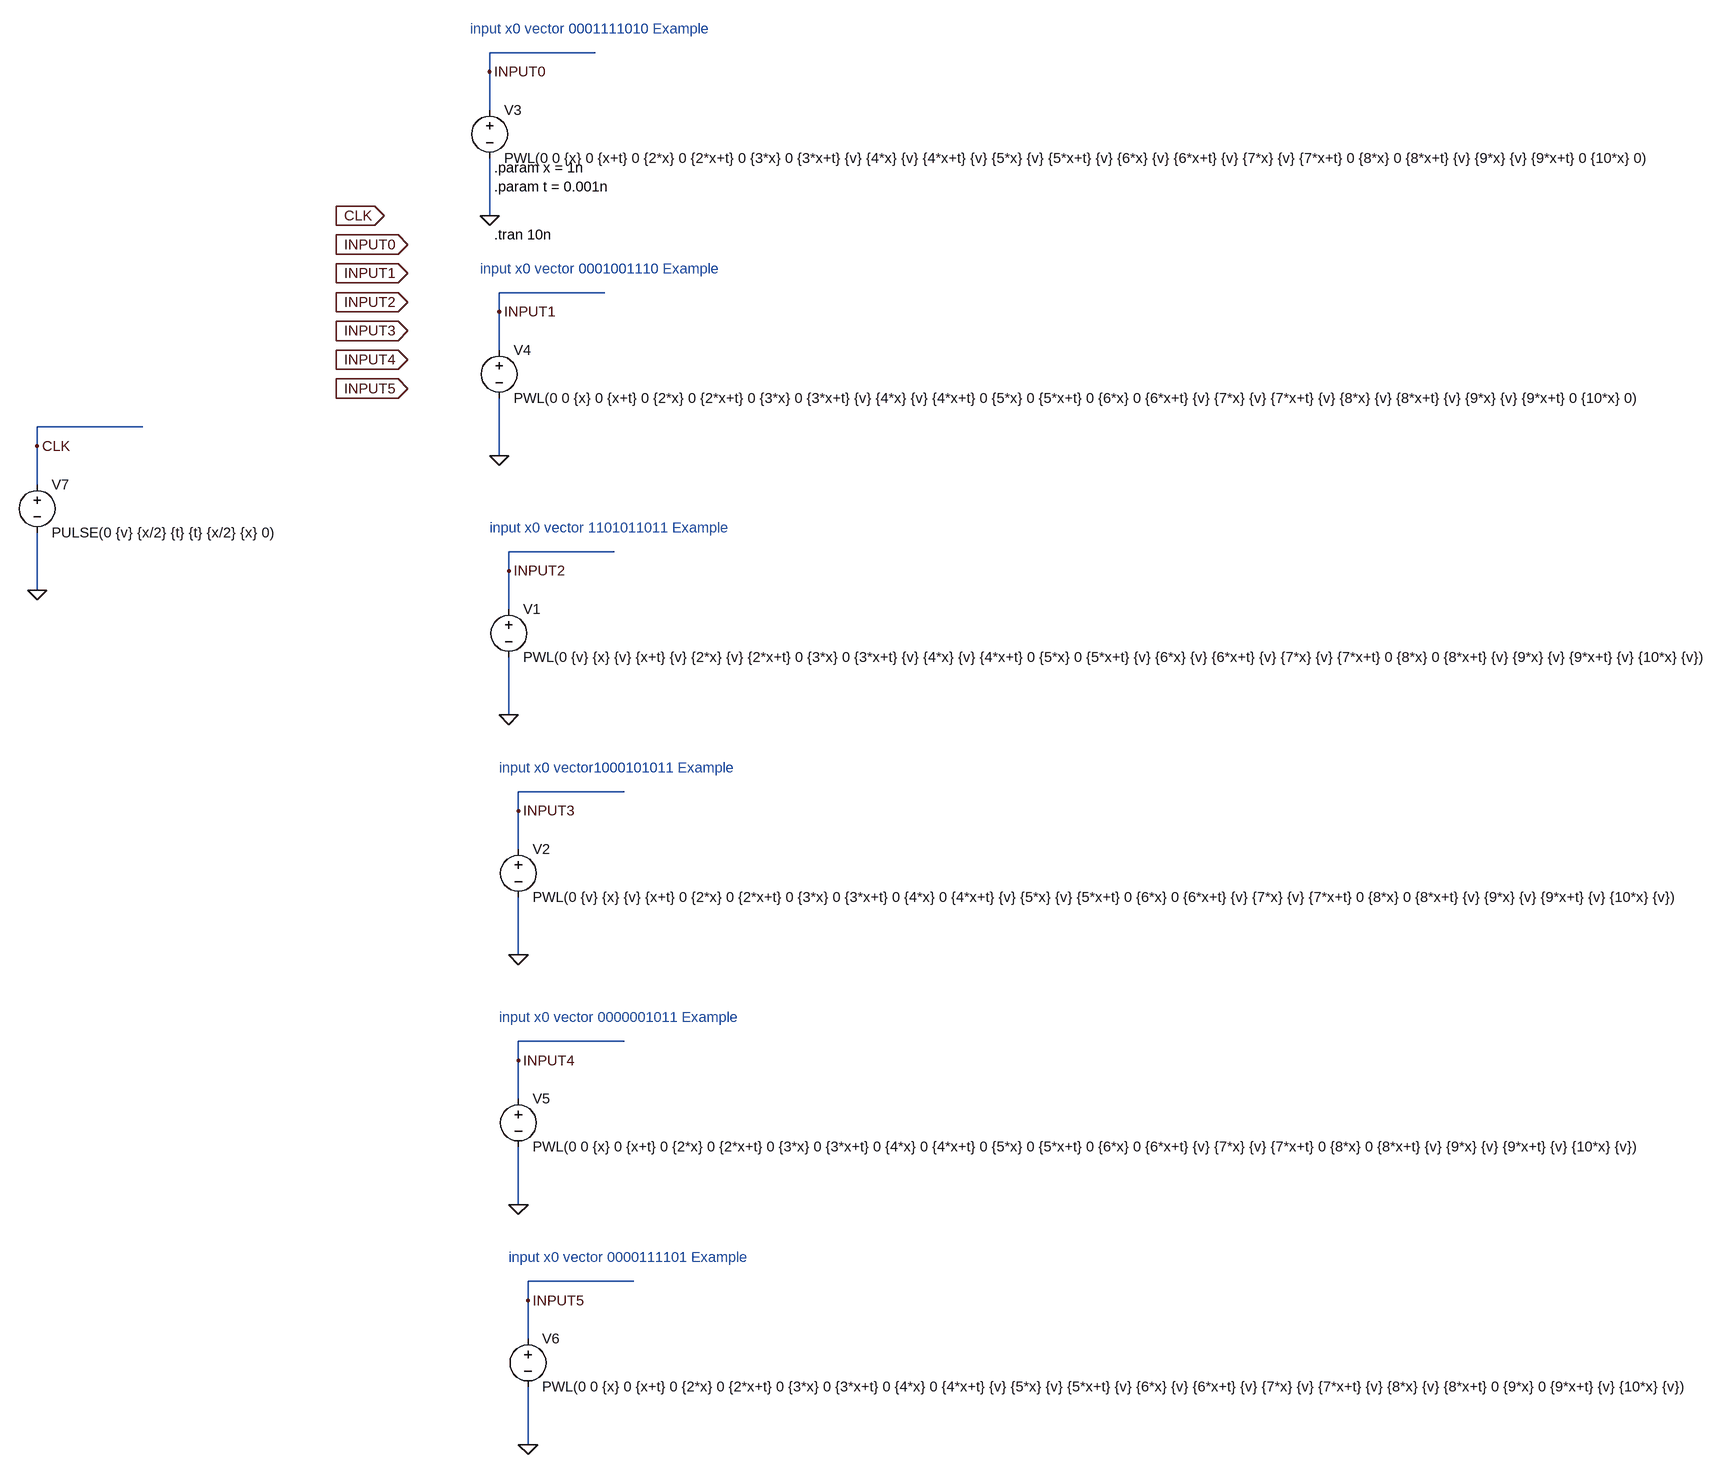
[diagram p0: schematic INPUT_GEN.asc]
INPUT_GEN.asc, the LTspice schematic file:
Version 4
SHEET 1 1944 1504
WIRE -528 -864 -704 -864
WIRE -704 -832 -704 -864
WIRE -704 -768 -704 -832
WIRE -704 -592 -704 -688
WIRE -512 -464 -688 -464
WIRE -688 -432 -688 -464
WIRE -688 -368 -688 -432
WIRE -2192 -240 -2368 -240
WIRE -2368 -208 -2368 -240
WIRE -688 -192 -688 -288
WIRE -2368 -144 -2368 -208
WIRE -496 -32 -672 -32
WIRE -672 0 -672 -32
WIRE -2368 32 -2368 -64
WIRE -672 64 -672 0
WIRE -672 240 -672 144
WIRE -480 368 -656 368
WIRE -656 400 -656 368
WIRE -656 464 -656 400
WIRE -656 640 -656 544
WIRE -480 784 -656 784
WIRE -656 816 -656 784
WIRE -656 880 -656 816
WIRE -656 1056 -656 960
WIRE -464 1184 -640 1184
WIRE -640 1216 -640 1184
WIRE -640 1280 -640 1216
WIRE -640 1456 -640 1360
FLAG -672 240 0
FLAG -672 0 INPUT2
FLAG -656 640 0
FLAG -656 400 INPUT3
FLAG -704 -592 0
FLAG -704 -832 INPUT0
FLAG -688 -192 0
FLAG -688 -432 INPUT1
FLAG -656 1056 0
FLAG -656 816 INPUT4
FLAG -640 1456 0
FLAG -640 1216 INPUT5
FLAG -2368 32 0
FLAG -2368 -208 CLK
FLAG -1856 -592 CLK
IOPIN -1856 -592 Out
FLAG -1856 -496 INPUT1
IOPIN -1856 -496 Out
FLAG -1856 -448 INPUT2
IOPIN -1856 -448 Out
FLAG -1856 -400 INPUT3
IOPIN -1856 -400 Out
FLAG -1856 -352 INPUT4
IOPIN -1856 -352 Out
FLAG -1856 -304 INPUT5
IOPIN -1856 -304 Out
FLAG -1856 -544 INPUT0
IOPIN -1856 -544 Out
SYMBOL voltage -672 48 R0
WINDOW 123 0 0 Left 0
WINDOW 39 0 0 Left 0
SYMATTR InstName V1
SYMATTR Value PWL(0 {v} {x} {v} {x+t} {v} {2*x} {v} {2*x+t} 0 {3*x} 0 {3*x+t} {v} {4*x} {v} {4*x+t} 0 {5*x} 0 {5*x+t} {v} {6*x} {v} {6*x+t} {v} {7*x} {v} {7*x+t} 0 {8*x} 0 {8*x+t} {v} {9*x} {v} {9*x+t} {v} {10*x} {v})
SYMBOL voltage -656 448 R0
WINDOW 123 0 0 Left 0
WINDOW 39 0 0 Left 0
SYMATTR InstName V2
SYMATTR Value PWL(0 {v} {x} {v} {x+t} 0 {2*x} 0 {2*x+t} 0 {3*x} 0 {3*x+t} 0 {4*x} 0 {4*x+t} {v} {5*x} {v} {5*x+t} 0 {6*x} 0 {6*x+t} {v} {7*x} {v} {7*x+t} 0 {8*x} 0 {8*x+t} {v} {9*x} {v} {9*x+t} {v} {10*x} {v})
SYMBOL voltage -704 -784 R0
WINDOW 123 0 0 Left 0
WINDOW 39 0 0 Left 0
SYMATTR InstName V3
SYMATTR Value PWL(0 0 {x} 0 {x+t} 0 {2*x} 0 {2*x+t} 0 {3*x} 0 {3*x+t} {v} {4*x} {v} {4*x+t} {v} {5*x} {v} {5*x+t} {v} {6*x} {v} {6*x+t} {v} {7*x} {v} {7*x+t} 0 {8*x} 0 {8*x+t} {v} {9*x} {v} {9*x+t} 0 {10*x} 0)
SYMBOL voltage -688 -384 R0
WINDOW 123 0 0 Left 0
WINDOW 39 0 0 Left 0
SYMATTR InstName V4
SYMATTR Value PWL(0 0 {x} 0 {x+t} 0 {2*x} 0 {2*x+t} 0 {3*x} 0 {3*x+t} {v} {4*x} {v} {4*x+t} 0 {5*x} 0 {5*x+t} 0 {6*x} 0 {6*x+t} {v} {7*x} {v} {7*x+t} {v} {8*x} {v} {8*x+t} {v} {9*x} {v} {9*x+t} 0 {10*x} 0)
SYMBOL voltage -656 864 R0
WINDOW 123 0 0 Left 0
WINDOW 39 0 0 Left 0
SYMATTR InstName V5
SYMATTR Value PWL(0 0 {x} 0 {x+t} 0 {2*x} 0 {2*x+t} 0 {3*x} 0 {3*x+t} 0 {4*x} 0 {4*x+t} 0 {5*x} 0 {5*x+t} 0 {6*x} 0 {6*x+t} {v} {7*x} {v} {7*x+t} 0 {8*x} 0 {8*x+t} {v} {9*x} {v} {9*x+t} {v} {10*x} {v})
SYMBOL voltage -640 1264 R0
WINDOW 123 0 0 Left 0
WINDOW 39 0 0 Left 0
SYMATTR InstName V6
SYMATTR Value PWL(0 0 {x} 0 {x+t} 0 {2*x} 0 {2*x+t} 0 {3*x} 0 {3*x+t} 0 {4*x} 0 {4*x+t} {v} {5*x} {v} {5*x+t} {v} {6*x} {v} {6*x+t} {v} {7*x} {v} {7*x+t} {v} {8*x} {v} {8*x+t} 0 {9*x} 0 {9*x+t} {v} {10*x} {v})
SYMBOL voltage -2368 -160 R0
WINDOW 123 0 0 Left 0
WINDOW 39 0 0 Left 0
SYMATTR InstName V7
SYMATTR Value PULSE(0 {v} {x/2} {t} {t} {x/2} {x} 0)
TEXT -704 -72 Left 2 ;input x0 vector 1101011011 Example
TEXT -688 328 Left 2 ;input x0 vector1000101011 Example
TEXT -696 -672 Left 2 !.param x = 1n
TEXT -696 -640 Left 2 !.param t = 0.001n
TEXT -696 -560 Left 2 !.tran 10n
TEXT -736 -904 Left 2 ;input x0 vector 0001111010 Example
TEXT -720 -504 Left 2 ;input x0 vector 0001001110 Example
TEXT -688 744 Left 2 ;input x0 vector 0000001011 Example
TEXT -672 1144 Left 2 ;input x0 vector 0000111101 Example

The netlist it stands for:
* INPUT_GEN.asc
V1 INPUT2 0 PWL(0 {v} {x} {v} {x+t} {v} {2*x} {v} {2*x+t} 0 {3*x} 0 {3*x+t} {v} {4*x} {v} {4*x+t} 0 {5*x} 0 {5*x+t} {v} {6*x} {v} {6*x+t} {v} {7*x} {v} {7*x+t} 0 {8*x} 0 {8*x+t} {v} {9*x} {v} {9*x+t} {v} {10*x} {v})
V2 INPUT3 0 PWL(0 {v} {x} {v} {x+t} 0 {2*x} 0 {2*x+t} 0 {3*x} 0 {3*x+t} 0 {4*x} 0 {4*x+t} {v} {5*x} {v} {5*x+t} 0 {6*x} 0 {6*x+t} {v} {7*x} {v} {7*x+t} 0 {8*x} 0 {8*x+t} {v} {9*x} {v} {9*x+t} {v} {10*x} {v})
V3 INPUT0 0 PWL(0 0 {x} 0 {x+t} 0 {2*x} 0 {2*x+t} 0 {3*x} 0 {3*x+t} {v} {4*x} {v} {4*x+t} {v} {5*x} {v} {5*x+t} {v} {6*x} {v} {6*x+t} {v} {7*x} {v} {7*x+t} 0 {8*x} 0 {8*x+t} {v} {9*x} {v} {9*x+t} 0 {10*x} 0)
V4 INPUT1 0 PWL(0 0 {x} 0 {x+t} 0 {2*x} 0 {2*x+t} 0 {3*x} 0 {3*x+t} {v} {4*x} {v} {4*x+t} 0 {5*x} 0 {5*x+t} 0 {6*x} 0 {6*x+t} {v} {7*x} {v} {7*x+t} {v} {8*x} {v} {8*x+t} {v} {9*x} {v} {9*x+t} 0 {10*x} 0)
V5 INPUT4 0 PWL(0 0 {x} 0 {x+t} 0 {2*x} 0 {2*x+t} 0 {3*x} 0 {3*x+t} 0 {4*x} 0 {4*x+t} 0 {5*x} 0 {5*x+t} 0 {6*x} 0 {6*x+t} {v} {7*x} {v} {7*x+t} 0 {8*x} 0 {8*x+t} {v} {9*x} {v} {9*x+t} {v} {10*x} {v})
V6 INPUT5 0 PWL(0 0 {x} 0 {x+t} 0 {2*x} 0 {2*x+t} 0 {3*x} 0 {3*x+t} 0 {4*x} 0 {4*x+t} {v} {5*x} {v} {5*x+t} {v} {6*x} {v} {6*x+t} {v} {7*x} {v} {7*x+t} {v} {8*x} {v} {8*x+t} 0 {9*x} 0 {9*x+t} {v} {10*x} {v})
V7 CLK 0 PULSE(0 {v} {x/2} {t} {t} {x/2} {x} 0)
* input x0 vector 1101011011 Example
* input x0 vector1000101011 Example
.param x = 1n
.param t = 0.001n
.tran 10n
* input x0 vector 0001111010 Example
* input x0 vector 0001001110 Example
* input x0 vector 0000001011 Example
* input x0 vector 0000111101 Example
.backanno
.end